# EAGLE schematic Flight Computer Bootloader (EAGLE 9.4.2)
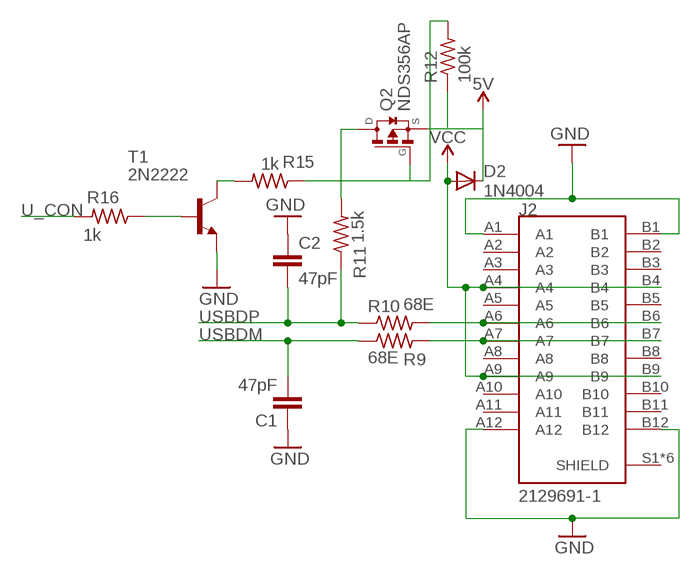
[diagram p0: schematic, sheet 1]

## Parts
C1  47pF  C2,5-3  [C2.5-3]
C2  47pF  C2,5-3  [C2.5-3]
D2  1N4004  [DO41-10]
J2  2129691-1  [TE_2129691-1]
Q2  NDS356AP  [SSOT-3]
R9  68E  R-US_0204/2V  [0204V]
R10  68E  R-US_0204/2V  [0204V]
R11  1.5k  R-US_0204/2V  [0204V]
R12  100k  R-US_0204/2V  [0204V]
R15  1k  R-US_0204/2V  [0204V]
R16  1k  R-US_0204/2V  [0204V]
T1  2N2222  [TO92-EBC-OVAL]

## Nets
5V: D2.C Q2.2(S)
GND: C1.1 C2.1 J2.A1 J2.A12 J2.B1 J2.B12 T1.E
N$7: J2.A6 J2.B6 R10.2
N$8: Q2.3(D) R11.2
N$9: R12.1
N$10: Q2.1(G) R12.2 R15.1
N$13: R15.2 T1.C
N$14: R16.1 T1.B
N$16: J2.A7 J2.B7 R9.2
U_CON: R16.2
USBDM: C1.2 R9.1
USBDP: C2.2 R10.1 R11.1
VCC: D2.A J2.A4 J2.A9 J2.B4 J2.B9
Unconnected: J2.A2 J2.A3 J2.A5 J2.A8 J2.A10 J2.A11 J2.B2 J2.B3 J2.B5 J2.B8 J2.B10 J2.B11 J2.S1(SHIELD) J2.S2(SHIELD) J2.S3(SHIELD) J2.S4(SHIELD) J2.S5(SHIELD) J2.S6(SHIELD)

## Library data of the parts
C1 C2 = capacitor-wima:C: CAPACITOR naming: grid - package width
D2 = adafruit:1N4004: DIODE General purpose 1N400x type rectifier (With bigger pads) http://www.ladyada.net/library/pcb/eaglelibrary.html
J2 = typeC:2129691-1: Conn USB 3.1 Type C RCP 24 POS Solder RA SMD 24 Terminal 1 Port T/R; AVAILABILITY: Unavailable; CENTERLINE_PITCH: .5 mm[.019 in]; COMMENT: 2129691-1; DESCRIPTION: USB3.1 TYPE-C REC MID-MOUNT 0.485 HYBRID; MF: TE Connectivity; MP: 2129691-1; NUMBER_OF_POSITIONS: 24; PACKAGE: None; PRICE: None; PRODUCT_TYPE: Connector; TE_PURCHASE_URL: https://www.te.com/usa-en/product-2129691-1.html?te_bu=Cor&te_type=disp&te_campaign=seda_glo_cor-seda-global-disp-prtnr-fy19-seda-model-bom-cta_sma-317_1&elqCampaignId=32493
Q2 = NDS356AP:NDS356AP: P-Channel Logic Level Enhancement Mode Field Effect Transistor; AVAILABILITY: Unavailable; DESCRIPTION: P-Channel 30 V 0.3 Ohm SMT Enhance Mode Field Effect Transistor - SSOT-3; MF: ON Semiconductor; MP: NDS356AP; PACKAGE: SC-59 ON Semiconductor; PRICE: None
R9-R12 R15 R16 = adafruit:R-US_: RESISTOR, American symbol
T1 = adafruit:2N2222: NPN TRANSISTOR Big oval pads

## Net classes
0 Default: width 0.203 mm